# Altium schematic sheet usbhub.SchDoc
size A4
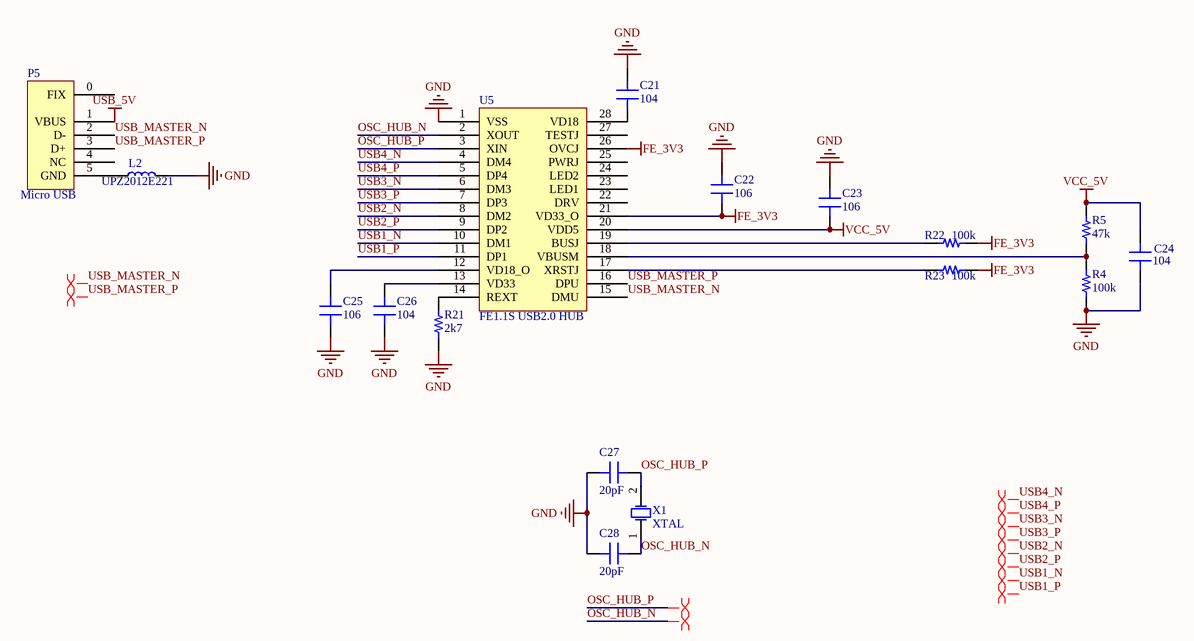
[diagram p0: usbhub.SchDoc]

## Parts
C21  104  [C0603/1608]
C22  106  [C0603/1608]
C23  106  [C0603/1608]
C24  104  [C0603/1608]
C25  106  [C0603/1608]
C26  104  [C0603/1608]
C27  20pF  [C0603/1608]
C28  20pF  [C0603/1608]
L2  UPZ2012E221  [L0805/2012]
P5  Micro USB  [Micro USB]
R4  100k  [R0603/1608]
R5  47k  [R0603/1608]
R21  2k7  [R0603/1608]
R22  100k  [R0603/1608]
R23  100k  [R0603/1608]
U5  FE1.1S USB2.0 HUB  [SOP65P780-28M]
X1  XTAL  [XTAL-49S]

## Nets
FE_3V3: C22.2 R22.1 R23.1 U5.21(VD33_O) U5.26(OVCJ)
GND: C21.1 C22.1 C23.1 C24.2 C25.2 C26.2 C27.2 C28.2 L2.1 R4.2 R21.1 U5.1(VSS)
USB_5V: P5.1(VBUS)
VCC_5V: C23.2 C24.1 R5.1 U5.20(VDD5)
OSC_HUB_N: C28.1 U5.2(XOUT) X1.1(OSC1)
OSC_HUB_P: C27.1 U5.3(XIN) X1.2(OSC2)
USB1_N: U5.10(DM1)
USB1_P: U5.11(DP1)
USB2_N: U5.8(DM2)
USB2_P: U5.9(DP2)
USB3_N: U5.6(DM3)
USB3_P: U5.7(DP3)
USB4_N: U5.4(DM4)
USB4_P: U5.5(DP4)
USB_MASTER_N: P5.2(D-) U5.15(DMU)
USB_MASTER_P: P5.3(D+) U5.16(DPU)
NetC21_2: C21.2 U5.28(VD18)
NetC25_1: C25.1 U5.12(VD18_O)
NetC26_1: C26.1 U5.13(VD33)
NetL2_2: L2.2 P5.5(GND)
NetR4_1: R4.1 R5.2 U5.18(VBUSM)
NetR21_2: R21.2 U5.14(REXT)
NetR22_2: R22.2 U5.19(BUSJ)
NetR23_2: R23.2 U5.17(XRSTJ)

Not connected (* = marked no-connect by the designer): P5 0(FIX) 4(NC); U5 22(DRV) 23(LED1) 24(LED2) 25(PWRJ) 27(TESTJ)

## Layout directives
differential pair: (no net found under the mark), OSC_HUB_N, OSC_HUB_P

## Notes on the sheet
- Labels drawn without touching a wire or pin: USB1_N, USB1_P, USB2_N, USB2_P, USB3_N, USB3_P, USB4_N, USB4_P, USB_MASTER_N, USB_MASTER_P

## Library data of the parts
C21-C28 = 陶瓷电容
L2 = 磁珠: 贴片磁珠
P5 = Micro USB: Micro USB底座
R4 R5 R21-R23 = 电阻
X1 = 晶振: Published: 8-Jun-2000; LatestRevisionDate: 17-Jul-2002; LatestRevisionNote: Re-released for DXP Platform.; Publisher: Altium Limited